# EAGLE design IotaWatt5.0 (EAGLE 9.2.2)
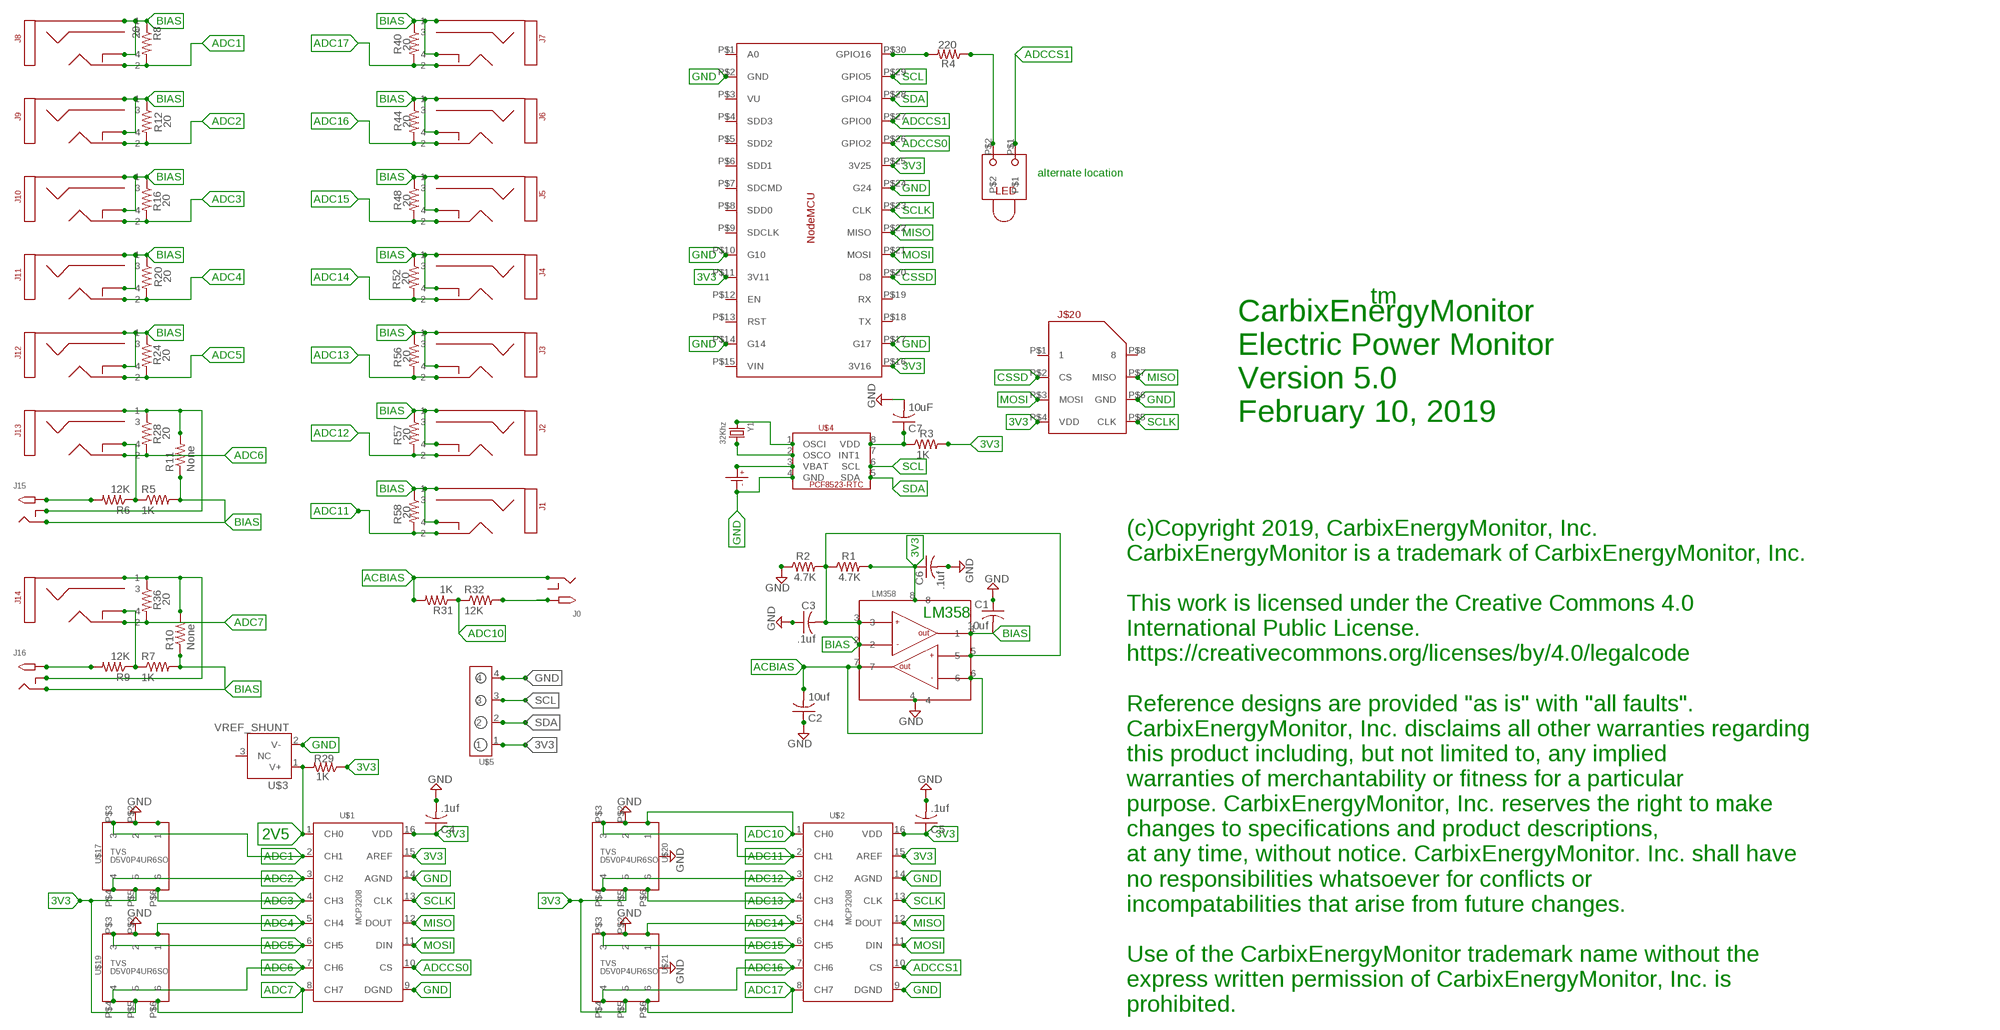
[diagram p0: schematic, sheet 1]

## Parts
C1  10uf  C-USC0805  [C0805]
C2  10uf  C-USC0805  [C0805]
C3  .1uf  C-USC0805  [C0805]
C4  .1uf  C-USC0805  [C0805]
C5  .1uf  C-USC0805  [C0805]
C6  .1uf  C-USC0805  [C0805]
C7  10uF  C-USC0805  [C0805]
J0  2.1MMJACKSMT  [DCJACK_2MM_SMT]
J1  STEREO_SMD  [STEREO_SMT]
J2  STEREO_SMD  [STEREO_SMT]
J3  STEREO_SMD  [STEREO_SMT]
J4  STEREO_SMD  [STEREO_SMT]
J5  STEREO_SMD  [STEREO_SMT]
J6  STEREO_SMD  [STEREO_SMT]
J7  STEREO_SMD  [STEREO_SMT]
J8  STEREO_SMD  [STEREO_SMT]
J9  STEREO_SMD  [STEREO_SMT]
J10  STEREO_SMD  [STEREO_SMT]
J11  STEREO_SMD  [STEREO_SMT]
J12  STEREO_SMD  [STEREO_SMT]
J13  STEREO_SMD  [STEREO_SMT]
J14  STEREO_SMD  [STEREO_SMT]
J15  2.1MMJACKSMT  [DCJACK_2MM_SMT]
J16  2.1MMJACKSMT  [DCJACK_2MM_SMT]
J$20  MICROSD_PUSH/PULL  [MICROSD]
R1  4.7K  R-US_R0805  [R0805]
R2  4.7K  R-US_R0805  [R0805]
R3  1K  R-US_R0805  [R0805]
R4  220  R-US_R0805  [R0805]
R5  1K  R-US_R0805  [R0805]
R6  12K  R-US_R0805  [R0805]
R7  1K  R-US_R0805  [R0805]
R8  20  R-US_R0805  [R0805]
R9  12K  R-US_R0805  [R0805]
R10  None  R-US_R0805  [R0805]
R11  None  R-US_R0805  [R0805]
R12  20  R-US_R0805  [R0805]
R16  20  R-US_R0805  [R0805]
R20  20  R-US_R0805  [R0805]
R24  20  R-US_R0805  [R0805]
R28  20  R-US_R0805  [R0805]
R29  1K  R-US_R0805  [R0805]
R31  1K  R-US_R0805  [R0805]
R32  12K  R-US_R0805  [R0805]
R36  20  R-US_R0805  [R0805]
R40  20  R-US_R0805  [R0805]
R44  20  R-US_R0805  [R0805]
R48  20  R-US_R0805  [R0805]
R52  20  R-US_R0805  [R0805]
R56  20  R-US_R0805  [R0805]
R57  20  R-US_R0805  [R0805]
R58  20  R-US_R0805  [R0805]
U$1  MCP3208  [SOIC_16]
U$2  MCP3208  [SOIC_16]
U$3  VREF_SHUNT  [SOT23_3]
U$4  PCF8523_RTC  [SOIC_8]
U$5  HEADER_1X4  [HEADER_1X4]
U$16  NODEMCU  [NODEMCU]
U$17  TVS_4CHAN_ARRAYSC-74  [SC-74]
U$18  CR1220SMD  [CR1220SMD]
U$19  TVS_4CHAN_ARRAYSC-74  [SC-74]
U$20  TVS_4CHAN_ARRAYSC-74  [SC-74]
U$21  TVS_4CHAN_ARRAYSC-74  [SC-74]
U$22  LM358_DUAL_OP-AMP  [SOIC_8]
U$23  LED_RT_TRH  [LED_TH_RT]
Y1  32Khz  CRYSTAL8X3.8SMT  [CRYSTAL_8X3.8]

## Nets
2V5: R29.2 U$1.1(CH0) U$3.1(V+)
3V3: C4.1 C5.1 C6.1 J$20.P$4(VDD) R1.2 R3.2 R29.1 U$1.15(AREF) U$1.16(VDD) U$2.15(AREF) U$2.16(VDD) U$5.1 U$16.P$11(3V11) U$16.P$16(3V16) U$16.P$25(3V25) U$17.P$5 U$19.P$5 U$20.P$5 U$21.P$5 U$22.8
ACBIAS: C2.2 J0.GND(RING) R31.2 U$22.6 U$22.7
ADC1: J8.P$2 R8.2 U$1.2(CH1) U$17.P$3
ADC2: J9.P$2 R12.2 U$1.3(CH2) U$17.P$4
ADC3: J10.P$2 R16.2 U$1.4(CH3) U$17.P$6
ADC4: J11.P$2 R20.2 U$1.5(CH4) U$19.P$1
ADC5: J12.P$2 R24.2 U$1.6(CH5) U$19.P$3
ADC6: J13.P$2 R28.2 U$1.7(CH6) U$19.P$4
ADC7: J14.P$2 R36.2 U$1.8(CH7) U$19.P$6
ADC10: R31.1 R32.1 U$2.1(CH0) U$20.P$1
ADC11: J1.P$2 R58.2 U$2.2(CH1) U$20.P$3
ADC12: J2.P$2 R57.2 U$2.3(CH2) U$20.P$4
ADC13: J3.P$2 R56.2 U$2.4(CH3) U$20.P$6
ADC14: J4.P$2 R52.2 U$2.5(CH4) U$21.P$1
ADC15: J5.P$2 R48.2 U$2.6(CH5) U$21.P$3
ADC16: J6.P$2 R44.2 U$2.7(CH6) U$21.P$4
ADC17: J7.P$2 R40.2 U$2.8(CH7) U$21.P$6
ADCCS0: U$1.10(CS) U$16.P$26(GPIO2)
ADCCS1: U$2.10(CS) U$16.P$27(GPIO0) U$23.P$1
BIAS: C1.2 J1.P$1 J1.P$4 J2.P$1 J2.P$4 J3.P$1 J3.P$4 J4.P$1 J4.P$4 J5.P$1 J5.P$4 J6.P$1 J6.P$4 J7.P$1 J7.P$4 J8.P$1 J8.P$4 J9.P$1 J9.P$4 J10.P$1 J10.P$4 J11.P$1 J11.P$4 J12.P$1 J12.P$4 J15.GND(RING) J16.GND(RING) R5.2 R7.2 R8.1 R10.1 R11.1 R12.1 R16.1 R20.1 R24.1 R40.1 R44.1 R48.1 R52.1 R56.1 R57.1 R58.1 U$22.1 U$22.2
CSSD: J$20.P$2(CS) U$16.P$20(D8)
GND: C1.1 C2.1 C3.1 C4.2 C5.2 C6.2 C7.2 J$20.P$6(GND) R2.1 U$1.9(DGND) U$1.14(AGND) U$2.9(DGND) U$2.14(AGND) U$3.2(V-) U$4.4(GND) U$5.4 U$16.P$2(GND) U$16.P$10(G10) U$16.P$14(G14) U$16.P$17(G17) U$16.P$24(G24) U$17.P$2 U$18.P-(P$-) U$19.P$2 U$20.P$2 U$21.P$2 U$22.4
MISO: J$20.P$7(MISO) U$1.12(DOUT) U$2.12(DOUT) U$16.P$22(MISO)
MOSI: J$20.P$3(MOSI) U$1.11(DIN) U$2.11(DIN) U$16.P$21(MOSI)
N$1: C7.1 R3.1 U$4.8(VDD)
N$2: J15.PWR2(TIP) R6.2
N$4: J16.PWR2(TIP) R9.2
N$5: J14.P$1 J16.GNDBREAK(RING_SW) R10.2 R36.1
N$6: J13.P$1 J15.GNDBREAK(RING_SW) R11.2 R28.1
N$7: J14.P$4 R7.1 R9.1
N$8: R4.1 U$23.P$2
N$9: J13.P$4 R5.1 R6.1
N$10: R4.2 U$16.P$30(GPIO16)
N$16: U$17.P$1
N$27: J0.PWR2(TIP) R32.2
N$43: U$4.3(VBAT) U$18.P+(P$+)
N$44: U$4.2(OSCO) Y1.P$4
N$45: U$4.1(OSCI) Y1.P$1
SCL: U$4.6(SCL) U$5.3 U$16.P$29(GPIO5)
SCLK: J$20.P$5(CLK) U$1.13(CLK) U$2.13(CLK) U$16.P$23(CLK)
SDA: U$4.5(SDA) U$5.2 U$16.P$28(GPIO4)
VREF: C3.2 R1.1 R2.2 U$22.3 U$22.5
Unconnected: J0.GNDBREAK(RING_SW) J1.P$3 J2.P$3 J3.P$3 J4.P$3 J5.P$3 J6.P$3 J7.P$3 J8.P$3 J9.P$3 J10.P$3 J11.P$3 J12.P$3 J13.P$3 J14.P$3 J$20.P$1 J$20.P$8 U$3.3(NC) U$4.7(INT1) U$16.P$1(A0) U$16.P$3(VU) U$16.P$4(SDD3) U$16.P$5(SDD2) U$16.P$6(SDD1) U$16.P$7(SDCMD) U$16.P$8(SDD0) U$16.P$9(SDCLK) U$16.P$12(EN) U$16.P$13(RST) U$16.P$15(VIN) U$16.P$18(TX) U$16.P$19(RX)

## Notes on the sheet
- alternate location
- tm
- CarbixEnergyMonitor
  Electric Power Monitor
  Version 5.0
  February 10, 2019
- LM358
- (c)Copyright 2019, CarbixEnergyMonitor, Inc.
  CarbixEnergyMonitor is a trademark of CarbixEnergyMonitor, Inc.
  
  This work is licensed under the Creative Commons 4.0
  International Public License. 
  https://creativecommons.org/licenses/by/4.0/legalcode
  
  Reference designs are provided "as is" with "all faults". 
  CarbixEnergyMonitor, Inc. disclaims all other warranties regarding
  this product including, but not limited to, any implied 
  warranties of merchantability or fitness for a particular 
  purpose. CarbixEnergyMonitor, Inc. reserves the right to make
  changes to specifications and product descriptions, 
  at any time, without notice. CarbixEnergyMonitor. Inc. shall have
  no responsibilities whatsoever for conflicts or 
  incompatabilities that arise from future changes.
  
  Use of the CarbixEnergyMonitor trademark name without the
  express written permission of CarbixEnergyMonitor, Inc. is
  prohibited.

## Library data of the parts
C1-C7 = adafruit:C-US: CAPACITOR, American symbol
J0 J15 J16 = CarbixEnergyMonitor_parts:2.1MMJACK: 2.1mm x 5.5mm THM DC jack with internal switch. Digikey part #PJ-102A, 4UCON part #05537 2.1mm x 5.5mm SMT DC jack with internal switch. Digikey part #PJ-002A-SMT, 4UCON part #03267 By microbuilder.eu & adafruit.com
J1-J14 = CarbixEnergyMonitor_parts:STEREO_SMD: 3.5mm Stereo Jack SMT
J$20 = CarbixEnergyMonitor_parts:MICROSD_PUSH/PULL: McroSD Amphenol push/pull
R1-R12 R16 R20 R24 R28 R29 R31 R32 R36 R40 R44 R48 R52 R56-R58 = adafruit:R-US_: RESISTOR, American symbol
U$1 U$2 = CarbixEnergyMonitor_parts:MCP3208: MCP3208 12bit SPI ADC
U$3 = CarbixEnergyMonitor_parts:VREF_SHUNT: Voltage Reference Shunt - SOT23-3 (ADR504, etc.)
U$4 = CarbixEnergyMonitor_parts:PCF8523_RTC: PCF8523-RTC SOIC-8
U$5 = CarbixEnergyMonitor_parts:HEADER_1X4
U$16 = CarbixEnergyMonitor_parts:NODEMCU: NodeMCU 1.0 ESP8266
U$17 U$19-U$21 = CarbixEnergyMonitor_parts:TVS_4CHAN_ARRAY: TVS 4 channel array
U$18 = CarbixEnergyMonitor_parts:CR1220SMD: CR1220 Battery SMD
U$22 = CarbixEnergyMonitor_parts:LM358_DUAL_OP-AMP: LM358 Dual Op-Amp - SOIC8
U$23 = CarbixEnergyMonitor_parts:LED_RT_TRH: LED RT ThruHole BiColor Digikey 67-2237-ND
Y1 = microbuilder:CRYSTAL: Crystals HC49UP - Surface Mount Crystal 4.0MHz 18pF +/-30ppm Surface Mount Crystal [Digikey: 535-9857-1-ND] 12.0 MHz Surface Mount Crystal [Digikey: 535-9869-6-ND] 25.0 MHz Surface Mount Crystal [Digikey: 535-9078-1-ND] 2.5 x 2.0mm - MEMs SMT Crystal 16.0 MHz 10pF 20ppm 2.5 x 2.0mm Crystal [Digikey -40-85°C: 535-10923-1-ND] 3.2 x 2.5mm - MEMs SMT Crystal 12.0 MHz 8pF 15ppm 3.2 x 2.5mm Crystal [Digikey: -10-70°C: 644-1047-1-ND -40-125°C: 644-1128-1-ND] 16.0 MHz 8pF 15ppm 3.2 x 2.5mm Crystal [Digikey: -10-70°C: 644-1049-1-ND -40-125°C: 644-1129-2-ND] 16.0 MHz 10pF 10ppm 3.2 x 2.5mm Crystal [Digikey: 644-1100-1-ND] 27.12 MHz 18pF 30ppm 3.2 x 2.5mm Crystal [Digikey: 887-1424-1-ND] 27.12MHz 10pF 10ppm 3.2 x 2.5mm Crystal [Digikey: 887-1329-1-ND] 4.9 x 1.8mm - MEMs SMT Crystal 32.768 KHz 12.5pF 20ppm 4.9 x 1.8mm Crystal [Digikey: SE2415CT-ND] 8.0 x 3.8mm - Surface Mount Crystal 32.768kHz 12.5pF 20ppm -40°C-85°C [Digikey: 535-9166-2-ND] Cylinder 32.768KHz Cylinder Crystal (2x6mm body) [Ex. Digikey: 300-8341-2-ND]

## Board
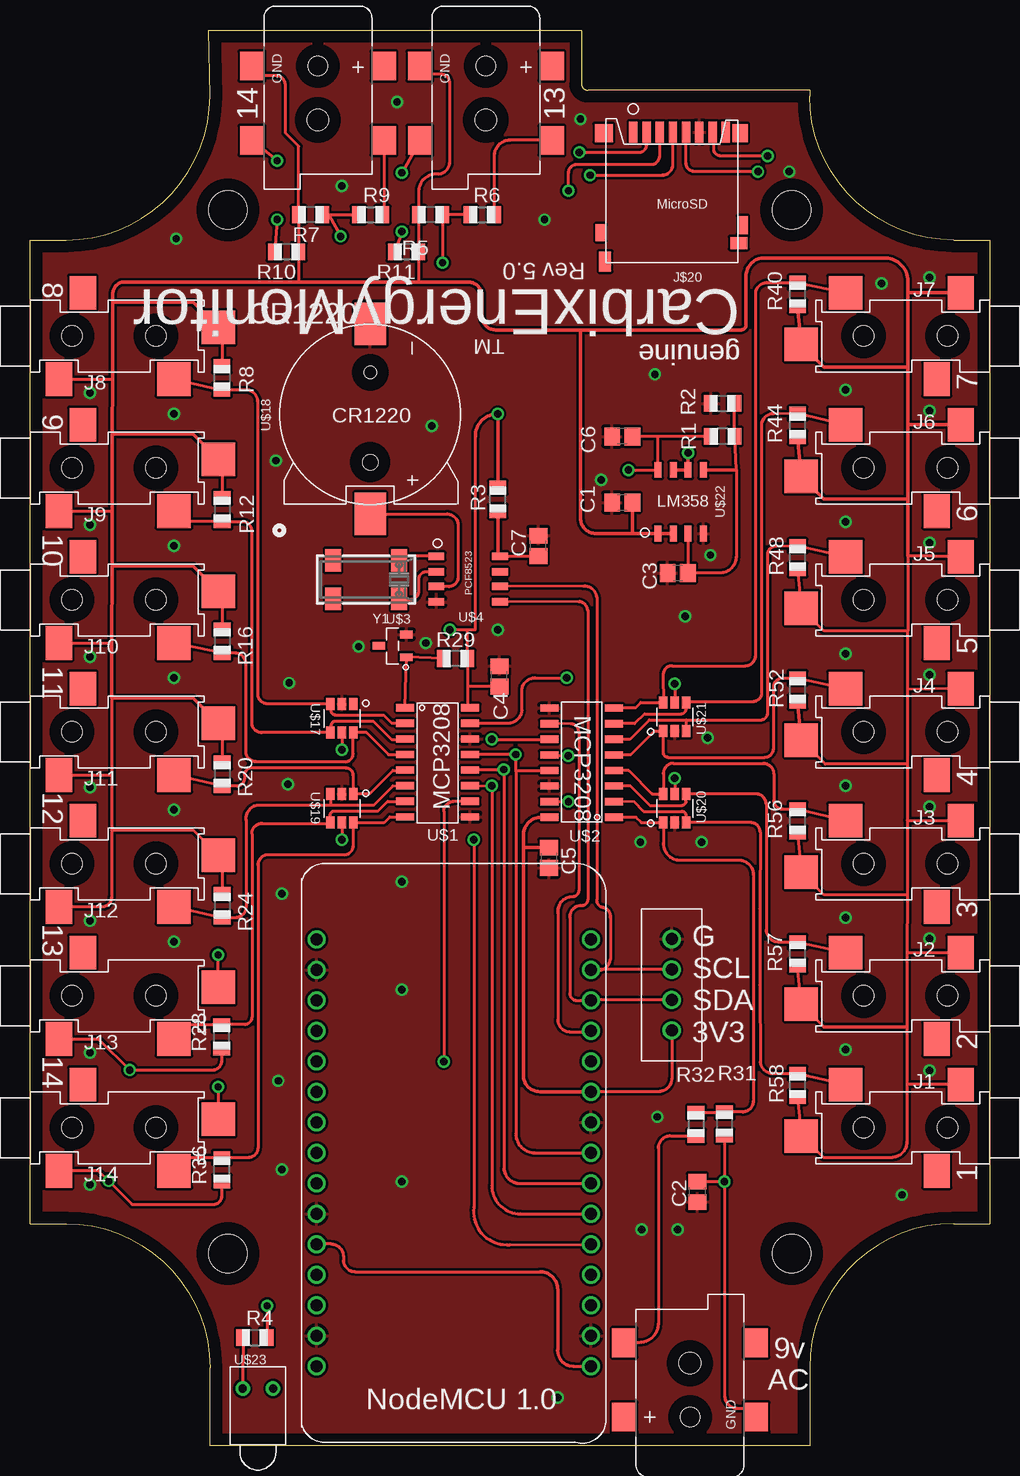
[diagram p1: board, top side]
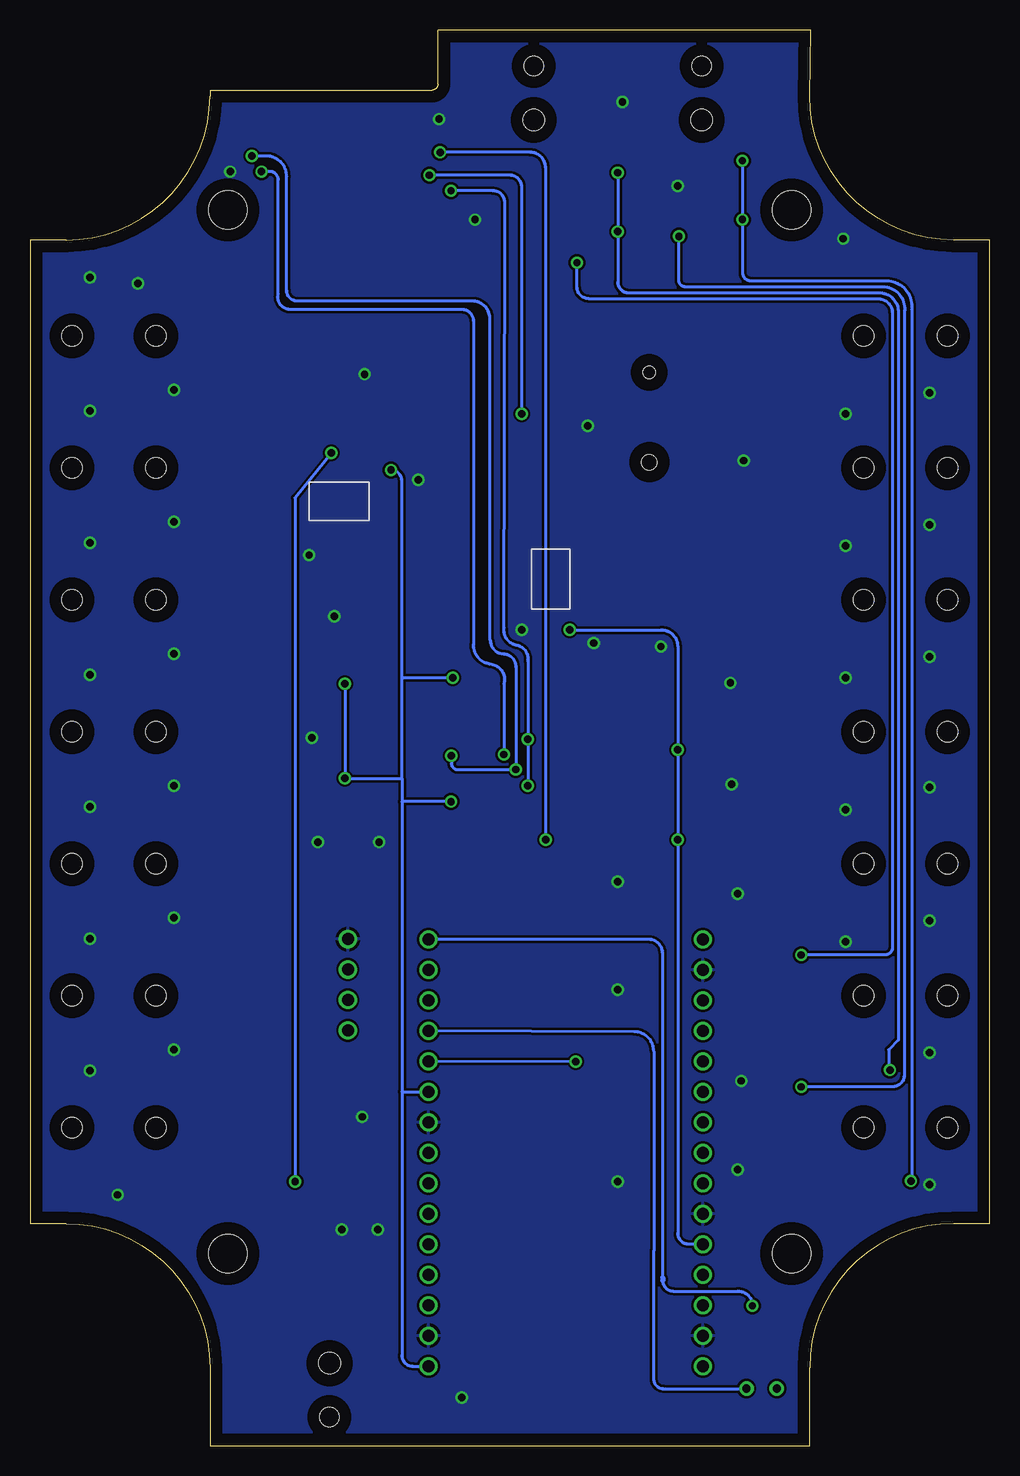
[diagram p2: board, bottom side, seen from below]

Size 80 x 118 mm. Coordinates in mm from the lower left corner, seen from the top.
Outline: 0,18.5 0,100.5 3,100.5 arc90 15,112.5 14.9,118 46,118 46,113.5 arc103 46.5,113 65,113 65,112.5 arc90 77,100.5 80,100.5 80,18.5 77,18.5 arc90 65,6.5 65,0 15,0 15,6.5 arc90 3,18.5 0,18.5
Copper layers (1*16): Top 0.035mm / dielectric 1.5mm / Bottom 0.035mm
Design rules "default *": minimum track width 10mil, minimum drill 10mil, track to track 8mil, track to pad 8mil, pad to pad 8mil, via to via 8mil, smd to smd 8mil, copper to edge 40mil, drill to drill 8mil, minimum pad ring 10mil, minimum via ring 8mil, stop-mask expansion 4mil, vias tented up to drill 0mil, thermal gap 10mil
Holes 3.2 mm at 16.5,16 63.5,16 16.5,103 63.5,103

### Footprints (pad centres in the part's own frame; a part is rotated, then mirrored left to right if it is on the bottom)
C0805 = smd 1.3 x 1.5: 1 -0.85,0; 2 0.85,0
DCJACK_2MM_SMT = smd 2.4 x 2: GND 0,-5.5; GNDBREAK 6.2,-5.5; PWR1 0,5.5; PWR2 6.2,5.5 | hole 1.6: 0,0 | hole 1.8: 4.5,0
STEREO_SMT = smd 2.8 x 2.2: P$1 -3.6,-2.4; P$3 3.6,-4.4 | smd 2.8 x 2.8: P$2 -3.6,-12; P$4 0.7,-15.7 | hole 1.7: 0,-3.5; 0,-10.5
MICROSD = smd 0.7 x 1.75: P$1 3.2,-0.9; P$2 2.1,-0.9; P$3 1,-0.9; P$4 -0.1,-0.9; P$5 -1.2,-0.9; P$6 -2.3,-0.9; P$7 -3.4,-0.9; P$8 -4.5,-0.9 | smd 1.3 x 1.5: P$9 -5.7,-0.8 | smd 1.5 x 1.5: P$10 5.65,-0.8 | smd 0.8 x 1.5: P$11 -5.95,6.85 | smd 0.8 x 1.4: P$13 5.95,7.5 | smd 1 x 1.65: P$CD1 5.55,9.9 | smd 1.45 x 1: P$CD2 -5.6,8.35
R0805 = smd 1.1 x 1.4: 1 -1,0; 2 1,0
SOIC_16 = smd 1.5 x 0.6: 1 -2.7,5.2; 2 -2.7,3.9; 3 -2.7,2.6; 4 -2.7,1.3; 5 -2.7,0; 6 -2.7,-1.3; 7 -2.7,-2.6; 8 -2.7,-3.9; 9 2.7,-3.9; 10 2.7,-2.6; 11 2.7,-1.3; 12 2.7,0; 13 2.7,1.3; 14 2.7,2.6; 15 2.7,3.9; 16 2.7,5.2
SOT23_3 = smd 1.05 x 0.65: 1 -1.15,0.95; 2 -1.15,-0.95; 3 1.15,0
SOIC_8 = smd 1.3 x 0.6: 1 -2.6,1.9; 2 -2.6,0.6; 3 -2.6,-0.6; 4 -2.6,-1.9; 5 2.7,-1.9; 6 2.7,-0.6; 7 2.7,0.6; 8 2.7,1.9
HEADER_1X4 = drill 1: 1 0,3.81; 2 0,1.27; 3 0,-1.27; 4 0,-3.81
NODEMCU = drill 1: P$1 -11.43,17.78; P$2 -11.43,15.24; P$3 -11.43,12.7; P$4 -11.43,10.16; P$5 -11.43,7.62; P$6 -11.43,5.08; P$7 -11.43,2.54; P$8 -11.43,0; P$9 -11.43,-2.54; P$10 -11.43,-5.08; P$11 -11.43,-7.62; P$12 -11.43,-10.16; P$13 -11.43,-12.7; P$14 -11.43,-15.24; P$15 -11.43,-17.78; P$16 11.43,-17.78; P$17 11.43,-15.24; P$18 11.43,-12.7; P$19 11.43,-10.16; P$20 11.43,-7.62; P$21 11.43,-5.08; P$22 11.43,-2.54; P$23 11.43,0; P$24 11.43,2.54; P$25 11.43,5.08; P$26 11.43,7.62; P$27 11.43,10.16; P$28 11.43,12.7; P$29 11.43,15.24; P$30 11.43,17.78
SC-74 = smd 1 x 0.7: P$1 -1.2,0.95; P$2 -1.2,0; P$3 -1.2,-0.95; P$4 1.2,-0.95; P$5 1.2,0; P$6 1.2,0.95
CR1220SMD = smd 3.54 x 2.6: P+ 8.3,0; P- -7.55,0 | hole 1: -3.5,0 | hole 1.3: 4,0
LED_TH_RT = drill 0.7: P$1 1.27,0; P$2 -1.27,0
CRYSTAL_8X3.8 = smd 1.3 x 1.9: P$1 -2.75,-1.6; P$2 2.75,-1.6; P$3 2.75,1.6; P$4 -2.75,1.6

### Placement (x,y rotation side)
C1  49.38,78.62 0 top
C2  55.63,21.15 90 top
C3  54,72.75 0 top
C4  39.12,64.12 90 top
C5  43.25,49 270 top
C6  49.38,84.12 180 top
C7  42.38,75 90 top
J0  55.03,2.37 90 top
J1  80,26.5 270 top
J2  80,37.5 270 top
J3  80,48.5 270 top
J4  80,59.5 270 top
J5  80,70.5 270 top
J6  80,81.5 270 top
J7  80,92.5 270 top
J8  0,92.5 90 top
J9  0,81.5 90 top
J10  0,70.5 90 top
J11  0,59.5 90 top
J12  0,48.5 90 top
J13  0,37.5 90 top
J14  0,26.5 90 top
J15  38,115 270 top
J16  24,115 270 top
J$20  53.5,108.6 180 top
R1  57.75,84.12 180 top
R2  57.75,86.88 0 top
R3  39,78.88 90 top
R4  18.75,9 0 top
R5  33.4,102.6 180 top
R6  37.7,102.6 0 top
R7  23.4,102.6 180 top
R8  16,89 270 top
R9  28.4,102.6 0 top
R10  21.4,99.5 180 top
R11  31.4,99.5 180 top
R12  16.03,78.02 270 top
R16  16.03,67.05 270 top
R20  16.03,55.96 270 top
R24  16.03,44.99 270 top
R28  15.97,34.07 90 top
R29  35.48,65.59 180 top
R31  57.91,26.82 270 top
R32  55.53,26.77 270 top
R36  15.99,22.99 90 top
R40  63.99,95.95 90 top
R44  63.99,85.05 90 top
R48  63.99,74.01 90 top
R52  63.99,62.98 90 top
R56  63.99,52.06 90 top
R57  63.99,40.98 90 top
R58  63.99,30.03 90 top
U$1  33.99,56.3 0 top
U$2  46.01,57.57 180 top
U$3  30.23,66.67 180 top
U$4  36.49,72.23 0 top
U$5  53.5,38.4 180 top
U$16  35.33,24.4 0 top
U$17  26,60.62 270 top
U$18  28.37,85.96 270 top
U$19  26,53.12 270 top
U$20  53.75,53.12 90 top
U$21  53.75,60.75 90 top
U$22  54.25,78.62 90 top
U$23  19,4.75 0 top
Y1  28.02,72.19 180 top

### Tracks (layer width: path | path; a pad name or v marks a point on that pad's centre or on a via)
2V5
  Top 0.254: U$1.1 U$3.1 R29.2
3V3  (via drill 0.6)
  Top 0.254: 42.5,14.5 27.09,14.5 arc-90 26.12,15.46 26.12,15.78 arc90 25.1,16.8 23.92,16.8 arc90 U$16.P$11 | 44.88,64 v44.75,64 42.12,64 arc90 41,62.88 41,61.35 arc-90 39.84,60.2 U$1.15 | 44,8 arc90 44,7.83 arc90 45.31,6.62 U$16.P$16 | 36.48,68 v35,68 | R1.2 52.37,84.12 | 52.37,84.12 C6.1 | 37.12,84.12 37.12,68 36.48,68 | v46.7,105.9 52.7,105.9 arc90 53.6,106.8 J$20.P$4 | 36.48,63.3 R29.1 36.48,68 | 36.48,63.3 36.48,61.71 arc90 U$1.16 | 36.48,63.3 39.1,63.3 arc-90 C4.1 | U$19.P$5 v26,50.5 | 52.25,81.33 U$22.8 | v49.9,81.33 U$22.8 | U$22.8 52.37,84.12 | v53.75,63.5 U$21.P$5 | v53.75,55.62 U$20.P$5 | U$2.15 v44.89,53.67 | U$17.P$5 v26,58 | U$5.1 53.5,30.6 arc-90 52.4,29.5 46.78,29.5 arc90 U$16.P$25
  Top 0.305: 42.5,14.5 arc-90 44,13 44,8 | U$2.16 42.62,52.37 arc90 41.12,50.88 41.12,50 | U$16.P$25 arc90 46.74,29.5 42.5,29.5 arc-90 41.12,30.88 41.12,50 | C5.1 41.27,49.85 arc-90 41.12,50 | 37.12,84.12 arc-90 v39,86 R3.2
  Bottom 0.254: v53.75,63.5 v53.75,55.62 49,55.62 | v35,68 27.38,68 arc90 26,66.62 v26,58 v26,50.5 26,17.7 arc-90 25.1,16.8 23.92,16.8 arc90 U$16.P$11 | v39,86 38.98,101.24 38.98,104.89 arc-90 40,105.9 v46.7,105.9 | 49,55.62 49,64 | v44.75,64 49,64 | v44.89,53.67 49,53.67 | v49.9,81.33 arc90 49,80.43 49,64 | U$16.P$16 48.08,6.61 arc90 49,7.54 49,29.5 | 49,55.62 49,53.67 | 49,53.67 49,29.5 | 49,29.5 U$16.P$25
ACBIAS  (via drill 0.6)
  Top 0.254: v57.9,22 C2.2 | v57.9,22 57.91,5 57.91,4.2 arc90 59,3.1 59.8,3.1 arc-90 J0.GND | R31.2 v57.9,22
  Top 0.305: U$22.7 U$22.6 54.85,82.62 v54.88,82.75
  Bottom 0.254: v54.88,82.75 57.9,79 v57.9,22
ADC1
  Top 0.254: U$1.2 arc90 31.25,60.25 30.12,60.25 29.5,60.88 25.52,60.88 arc-90 25.1,61.3 25.1,61.77 arc90 U$17.P$3 19.8,61.83 arc-90 19,62.62 19,87 arc90 18,88 R8.2 arc90 R8.2 J8.P$2
ADC2
  Top 0.254: J9.P$2 12.88,77.02 R12.2 arc90 16.05,77 17.75,77 arc-90 18.5,76.25 18.5,60.25 arc90 19.32,59.42 U$17.P$4 arc90 25.1,59.48 25.1,60 arc-90 25.48,60.38 28.62,60.38 30.12,58.88 31.26,58.88 U$1.3
ADC3
  Top 0.254: J10.P$2 R16.2 17.12,66.06 arc-90 18,65.18 18,57.88 arc90 18.88,57 26.29,57 arc90 26.94,57.65 U$17.P$6 28.05,59.42 29.88,57.6 U$1.4
ADC4
  Top 0.254: U$1.5 31.26,56.27 30.25,56.27 28.25,54.27 28.25,54.33 U$19.P$1 26.93,55.88 arc90 26.32,56.5 18.5,56.5 arc90 17.88,55.88 17.88,55.6 arc-90 17.24,54.97 R20.2 arc90 R20.2 J11.P$2
ADC5
  Top 0.254: 25.1,53.38 28.62,53.38 30.25,55 U$1.6 | 25.1,53.38 19,53.38 arc90 18,52.12 18,44.88 arc-90 17.12,44 R24.2 J12.P$2 | U$19.P$3 25.05,53.42 arc90 25.1,53.38
ADC6
  Top 0.254: J13.P$2 12,35.07 R28.2 arc-90 16,35.1 17.9,35.1 arc90 18.5,35.7 18.5,51 arc-90 19.38,51.88 25,51.88 U$19.P$4 25,51.98 25,52.5 arc-90 25.38,52.88 29,52.88 29.84,53.72 29.84,53.7 U$1.7 31.2,53.62
ADC7
  Top 0.254: J14.P$2 12,23.99 R36.2 arc-90 16,24 18.2,24 arc90 19,24.8 19,48.38 arc-90 19.88,49.25 26.18,49.25 arc90 26.96,50.02 U$19.P$6 | U$1.8 30.02,52.41 29.52,51.91 U$19.P$6 | U$19.P$6 arc90 U$19.P$6
ADC10
  Top 0.254: 55.5,27.8 arc-90 R32.1 57.86,27.77 | 57.86,27.77 arc90 R31.1 | U$2.1 50.52,52.38 50.97,51.93 U$20.P$1 52.8,50.2 arc90 54.2,48.8 59.1,48.8 arc-90 60.3,47.6 60.3,28.7 arc-90 59.4,27.8 57.89,27.8 arc90 57.86,27.77
ADC11
  Top 0.254: U$2.2 50.38,53.66 51.16,52.88 54.33,52.88 arc-90 54.7,52.5 U$20.P$3 60.1,51.92 arc-90 60.88,51.16 arc1 60.88,32 arc89 61.97,31.03 R58.2 J1.P$2
ADC12
  Top 0.254: U$20.P$4 54.7,53.7 arc-90 54.38,53.38 51.67,53.38 50.08,54.97 U$2.3 | U$20.P$4 | U$20.P$4 60.52,54.33 arc-90 61.38,53.47 61.38,43 arc90 62.38,42 R57.2 J2.P$2
ADC13
  Top 0.254: U$2.4 49.93,56.27 51.87,54.33 U$20.P$6 52.8,56.01 arc-90 53.66,56.88 61.12,56.88 arc-90 62,56 62,53.8 arc90 62.74,53.06 R56.2 J3.P$2
ADC14
  Top 0.254: U$2.5 50.06,57.58 52.05,59.56 U$21.P$1 52.8,57.77 arc90 53.2,57.38 61.25,57.38 arc90 62,58.12 62,63.22 arc-90 62.77,63.99 R52.2 J4.P$2
ADC15
  Top 0.254: 54.7,60.5 51.62,60.5 50,58.88 U$2.6 | 54.7,60.5 61,60.5 arc90 61.5,61.12 61.5,74.25 arc-90 62.25,75 R48.2 J5.P$2 | 54.7,60.5 U$21.P$3
ADC16
  Top 0.254: U$2.7 50.41,60.17 51.23,61 54.3,61 arc90 54.7,61.4 U$21.P$4 arc-90 54.75,62 60.25,62 arc90 61,62.75 61,85.02 arc-90 62.02,86.04 R44.2 J6.P$2
ADC17
  Top 0.254: U$2.8 48.73,61.5 50.48,61.5 50.92,61.94 50.92,61.95 U$21.P$6 52.78,64.25 arc-90 53.53,65 59.62,65 arc90 60.5,65.88 60.5,95.99 arc-90 61.46,96.95 R40.2 J7.P$2
ADCCS0  (via drill 0.6)
  Top 0.254: v34.5,32 34.5,52.86 arc-90 35.35,53.71 U$1.10 arc-90 U$1.10
  Bottom 0.254: v34.5,32 U$16.P$26
ADCCS1
  Top 0.254: U$16.P$27 arc-90 46.7,34.5 45,34.5 arc-90 44,35.5 44,44.38 arc-95 45.25,45.75 arc90 45.75,46.25 45.75,59.5 arc90 45.09,60.16 U$2.10
  Bottom 0.254: U$23.P$1 arc90 U$23.P$1 27.2,4.74 arc90 28,5.54 28,16.25 arc90 28,16.25 28,32.88 arc-90 29.62,34.5 U$16.P$27
BIAS
  Top 0.254: R24.1 16.03,49.2 J12.P$4 13.6,51.3 6.8,51.3 | J11.P$4 16.03,60.2 R20.1 | J10.P$4 16.03,71.2 R16.1 | J9.P$4 16.03,82.2 R12.1 | J8.P$4 16,93.2 R8.1 | 73.15,63.03 73.14,56.8 | 73.14,56.8 73.14,52.12 | 73.11,30.09 73.1,25.3 arc-90 71.8,24 66.2,24 J1.P$4 R58.1 | J1.P$1 73.11,30.09 | 73.11,30.09 73.11,34.9 73.12,41.1 | J4.P$1 73.15,63.03 | 73.13,45.9 66.2,45.9 J3.P$4 R56.1 | 73.14,56.8 66.3,56.8 J4.P$4 | 6.8,62.3 6.8,55.9 | 6.8,55.9 6.8,51.3 | 32.4,97.1 arc90 32.5,97 arc-90 32.4,97.1 | 2.72,56.22 arc90 J11.P$1 6.8,55.9 | 6.8,51.3 6.8,45.7 arc-90 6,44.9 J12.P$1 | 73.17,74.18 73.17,67.91 arc-90 73.16,67.9 | 73.16,67.9 73.16,63.04 arc-90 73.15,63.03 | 73.16,67.9 66.2,67.9 J5.P$4 R48.1 | 73.14,52.12 73.13,45.9 | 73.14,52.12 J3.P$1 | 73.13,45.9 73.12,41.1 | 73.12,41.1 J2.P$1 | J8.P$1 6.88,88.9 | J9.P$1 6.85,77.9 | J10.P$1 6.82,66.9 | 66.2,34.9 J2.P$4 R57.1 | J15.GND arc90 33.2,114.3 34.3,114.3 arc-90 35,113.6 35,107 arc-90 34,106 33.9,106 arc90 32.4,104.5 R5.2 R11.1 32.4,97.1 | J16.GND arc90 18.3,114.2 20.5,114.2 arc-90 21.3,113.4 21.3,109.4 22.4,108.3 R7.2 R10.1 22.4,97
  Top 0.305: U$22.2 U$22.1 50.2,76.03 | 50.2,76.03 47.17,76.03 arc-90 45.9,77.3 45.9,93 | C1.2 50.23,76.05 arc-90 50.2,76.03 | 45.9,93 arc90 46,93 | 45.9,93 38.8,93 arc-90 37.7,94.1 37.7,95.8 arc90 36.5,97 32.5,97 22.4,97 7.9,97 arc90 6.9,96 6.9,95.3 | 6.9,95.3 6.88,88.9 6.87,84.3 | 6.87,84.3 6.85,77.9 6.83,73.3 | 6.83,73.3 6.82,66.9 6.8,62.3 13.6,62.3 J11.P$4 | 6.9,95.3 13.6,95.3 J8.P$4 | 6.87,84.3 13.6,84.3 J9.P$4 | 6.83,73.3 13.6,73.3 J10.P$4 | J7.P$1 73.2,96.1 | 73.18,85.12 73.18,78.9 | 73.18,78.9 73.17,74.18 J5.P$1 | 73.18,85.12 73.19,89.9 | 73.19,89.9 73.2,96.1 | J6.P$1 73.18,85.12 | 73.11,34.9 66.2,34.9 | 73.18,78.9 66.2,78.9 J6.P$4 R44.1 | 73.19,89.9 66.2,89.9 J7.P$4 R40.1 | R52.1 J4.P$4 | 73.2,96.1 73.2,97.1 arc90 71.2,99 arc-90 71.1,99 61.2,99 arc90 59.7,97.5 59.7,93.4 arc-90 59.3,93 45.9,93
CSSD  (via drill 0.6)
  Top 0.254: v37,50.5 37,19.88 arc103 40,16.75 U$16.P$20 | v45.8,107.8 50.8,107.8 arc90 51.4,108.4 J$20.P$2
  Bottom 0.254: 45.9,107.8 v45.8,107.8 38.3,107.8 arc90 37,106.5 v37,50.5
GND  (via drill 0.6)
  Bottom 0.254: v21.5,55.12 arc-90 21.38,55
  other vias: 63.3,106.2 75,86.25 75,75.25 75,64.25 75,53.25 75,42.25 75,31.25 72.7,20.9 26,105 5,87.75 5,76.75 5,65.75 5,54.88 5,43.75 5,32.75 5,21.75 31,47 39,68 33.5,85 33,66.9 27.4,66.6 56.5,59 56,50.3 21.6,63.58 12.2,100.6 54.62,69.12 50.9,50.3 31,38 31,22 30.6,112 45.9,110.58 75,97.38 71,96.88 68,88 68,77 68,66 68,55 68,44 68,33 20.7,30.4 12,42 12,53 12,64 12,75 12,86 20.5,82.1 52.1,89.3 47.62,80.5 52.3,27.4 51,18 54,18 44,4 21,23 21,46 56.73,74.22 42.9,102.2
  pour Top: 0,0 0,118 80,118 80,0
  pour Bottom: -0.1,0 -0.1,118.1 80,118.1 80,0
MISO  (via drill 0.6)
  Top 0.254: v61.5,107.5 57.6,107.5 arc-90 57,108.1 57,109.4 arc90 J$20.P$7 | U$16.P$22 arc-90 U$16.P$22 41,21.85 arc-90 39.5,23.1 v39.5,56.35 39.5,56.3 U$1.12 | v44.88,57.5 43.38,57.5 arc-90 U$2.12
  Bottom 0.254: v44.88,57.5 44.88,56.88 arc-100 44.24,56.35 v39.5,56.35 | v39.5,56.35 39.5,64.88 arc-90 40.5,66 arc90 41.63,67.13 41.66,93.89 41.66,93.96 arc-90 43.1,95.4 57.7,95.4 arc90 58.6,96.3 58.6,105.8 arc-90 60.3,107.5 v61.5,107.5 | v39.5,56.35 arc-90 39.38,56.23
MOSI  (via drill 0.6)
  Top 0.254: v44.9,104.6 44.9,106.1 arc-90 45.6,106.8 51.8,106.8 arc90 52.5,107.5 J$20.P$3 | v38.5,58.88 U$2.11 | U$16.P$21 40.87,19.32 arc-90 38.5,21.68 v38.5,55 U$1.11
  Bottom 0.254: v38.5,55 v38.5,58.88 38.5,65.38 arc-90 39.5,66.75 arc90 40.48,68.22 40.4,100.8 40.4,103.6 arc-90 41.4,104.6 v44.9,104.6 45,104.6
N$1
  Top 0.254: U$4.8 C7.1
  Top 0.305: R3.1 39,74.32 arc90 U$4.8
N$2
  Top 0.254: J15.PWR2 40,108.8 arc90 38.7,107.5 R6.2
N$4
  Top 0.254: J16.PWR2 29.5,102.7 arc-90 R9.2
N$5  (via drill 0.6)
  Top 0.254: J16.GNDBREAK v20.6,107.1 | v20.6,102.2 R10.2 | R36.1 16,20.8 arc-90 15.3,20.1 8.5,20.1 v6.55,22.05 5.7,22.9 J14.P$1
  Bottom 0.254: v20.6,107.1 v20.6,102.2 20.6,97.8 arc-90 19.9,97.1 8.6,97.1 arc98 6.5,94.7 6.5,22.1 v6.55,22.05
N$6  (via drill 0.6)
  Top 0.254: J13.P$1 5.7,33.9 v8.3,31.3 15.2,31.3 arc90 16,32.1 16,33.04 arc90 R28.1 | J15.GNDBREAK v31,106.1 | v31,101.2 R11.2
  Bottom 0.254: v31,106.1 v31,101.2 31,97 arc-90 30.1,96.1 9.2,96.1 arc90 7.6,94.5 7.6,33.8 8.4,33 8.4,31.4 v8.3,31.3
N$7  (via drill 0.6)
  Top 0.254: R7.1 24.9,102.6 | 24.9,102.6 R9.1 | 24.9,102.6 v25.9,100.8 | v15.7,29.9 J14.P$4
  Bottom 0.254: v15.7,29.9 8.1,29.9 arc-90 7.1,30.9 7.1,94.5 arc-99 8.9,96.6 25.4,96.6 arc90 25.9,97.1 v25.9,100.8
N$8
  Top 0.254: R4.1 U$23.P$2
N$9  (via drill 0.6)
  Top 0.254: R6.1 R5.1 v34.4,98.6 | J13.P$4 v15.7,40.9
  Bottom 0.254: v15.7,40.9 8.7,40.9 arc-90 8.1,41.5 8.1,94.4 arc-90 9.3,95.6 33.4,95.6 arc90 34.4,96.6 v34.4,98.6
N$10  (via drill 0.6)
  Top 0.254: v19.77,11.64 19.77,9.02 arc-90 R4.2
  Bottom 0.254: 27.25,14 27.25,41.03 arc-90 28.41,42.19 U$16.P$30 | 27.25,13.75 arc-90 26.38,12.88 21,12.88 arc90 v19.77,11.64
  Bottom 0.406: 27.25,14 27.25,13.75
N$27
  Top 0.254: R32.2 arc90 55.5,25.8 53.4,25.8 arc90 52.38,24.77 52.38,10.16 arc-90 50.8,8.58 J0.PWR2 arc90 J0.PWR2
N$43
  Top 0.254: U$18.P+ 34.74,77.66 arc-90 35.7,76.7 35.7,72.4 arc-90 34.9,71.6 33.92,71.6 arc-90 U$4.3
N$44
  Top 0.254: U$4.2 33.03,72.83 arc90 32.4,72.2 32.4,71.2 arc-90 31.7,70.5 30.86,70.5 arc-90 Y1.P$4
N$45
  Top 0.254: U$4.1 31.11,74.13 arc90 Y1.P$1
SCL
  Top 0.254: U$4.6 46.12,71.62 arc-90 47.25,70.75 47.25,45.5 arc90 47.75,44.88 arc-90 48.38,44 48.38,40.51 arc-90 47.38,39.65 U$16.P$29 arc-90 46.79,39.67 U$5.3
SCLK  (via drill 0.6)
  Top 0.254: 40.5,56.2 40.5,26 arc90 42.1,24.4 U$16.P$23 | v60.7,106.2 55.4,106.2 arc-90 54.7,106.9 J$20.P$5 | 40.5,56.2 40.49,56.2 v40.49,57.61 U$1.13 | 40.5,56.2 40.57,56.27 U$2.13
  Bottom 0.254: v40.49,57.61 40.49,63.49 arc-97 41.5,65.12 arc94 43,66.88 43,93.7 arc-90 44,94.7 58.3,94.7 arc105 59.3,96 59.3,105.5 arc-90 60,106.2 v60.7,106.2
SDA
  Top 0.254: U$4.5 45.77,70.34 arc-82 46.5,69.61 46.5,45.5 arc-90 46,45 arc98 45,44 45,37.7 arc90 45.6,37.1 U$16.P$28 arc-90 46.79,37.13 U$5.2
VREF
  Top 0.254: R2.2 arc5 R1.1 58.88,81.33 58.88,74.09 arc-90 57.52,72.74 C3.2 U$22.3
  Top 0.305: U$22.5 58.88,81.33

### Text on the board
tSilk: 14 | 13 | Rev 5.0 | 8 | CarbixEnergyMonitor | CR1220 | genuine | genuine | 7 | 9 | 6 | 10 | 5 | 11 | 4 | 12 | 13 | 3 | G / SCL / SDA / 3V3 | 2 | 14 | 1 | NodeMCU 1.0
_tsilk: TM | LM358 | PCF8523 | MCP3208 | (c)Copyright 2019, CarbixEnergyMonitor, Inc. / CarbixEnergyMonitor is a trademark of CarbixEnergyMonitor, Inc. / / This work is licensed under the Creative Commons 4.0 / International Public License. / https://creativecommons.org/licenses/by/4.0/legalcode / / Reference designs are provided "as is" with "all faults". / CarbixEnergyMonitor, Inc. disclaims all other warranties regarding / this product including, but not limited to, any implied / warranties of merchantability or fitness for a particular / purpose. CarbixEnergyMonitor, Inc. reserves the right to make / changes to specifications and product descriptions, / at any time, without notice. CarbixEnergyMonitor. Inc. shall have / no responsibilities whatsoever for conflicts or / incompatabilities that arise from future changes. / / Use of the CarbixEnergyMonitor trademark name without the / express written permission of CarbixEnergyMonitor, Inc. is / prohibited. | MCP3208 | 9v | AC